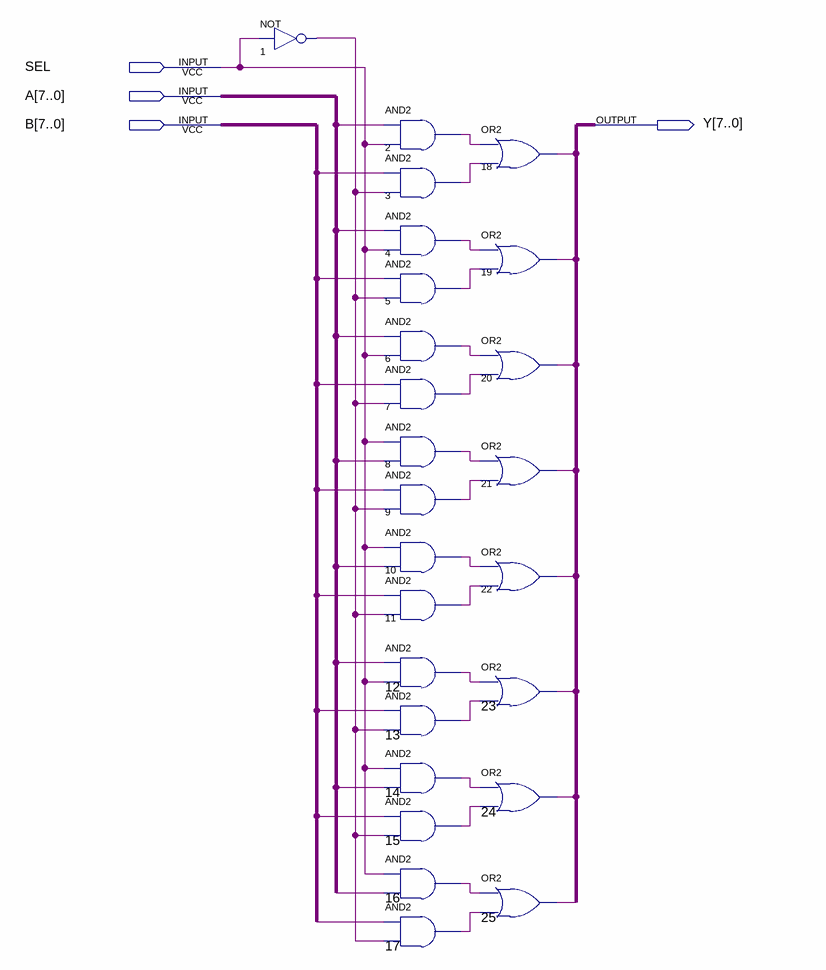
[diagram p0: schematic sheet]
// Quartus schematic multiplexador_8.bdf as structural Verilog: 25 symbols, 4 pins
module multiplexador_8 (
  input  SEL,
  input  [7:0] A,
  input  [7:0] B,
  output [7:0] Y
);

  wire n1_out, n2_out, n3_out, n4_out, n5_out, n6_out, n7_out, n8_out, n9_out, n10_out, n11_out, n12_out,
       n13_out, n14_out, n15_out, n16_out, n17_out;

  not u_1 (n1_out, SEL);
  and u_2 (n2_out, A[0], SEL);
  and u_3 (n3_out, B[0], n1_out);
  and u_4 (n4_out, A[1], SEL);
  and u_5 (n5_out, B[1], n1_out);
  and u_6 (n6_out, A[2], SEL);
  and u_7 (n7_out, B[2], n1_out);
  and u_8 (n8_out, SEL, A[3]);
  and u_9 (n9_out, B[3], n1_out);
  and u_10 (n10_out, SEL, A[4]);
  and u_11 (n11_out, B[4], n1_out);
  and u_12 (n12_out, A[5], SEL);
  and u_13 (n13_out, B[5], n1_out);
  and u_14 (n14_out, SEL, A[6]);
  and u_15 (n15_out, B[6], n1_out);
  and u_16 (n16_out, SEL, A[7]);
  and u_17 (n17_out, B[7], n1_out);
  or u_18 (Y[0], n2_out, n3_out);
  or u_19 (Y[1], n4_out, n5_out);
  or u_20 (Y[2], n6_out, n7_out);
  or u_21 (Y[3], n8_out, n9_out);
  or u_22 (Y[4], n10_out, n11_out);
  or u_23 (Y[5], n12_out, n13_out);
  or u_24 (Y[6], n14_out, n15_out);
  or u_25 (Y[7], n16_out, n17_out);
endmodule
